# EAGLE design badge (EAGLE 8.2.2)

## Sheet 1 of 4
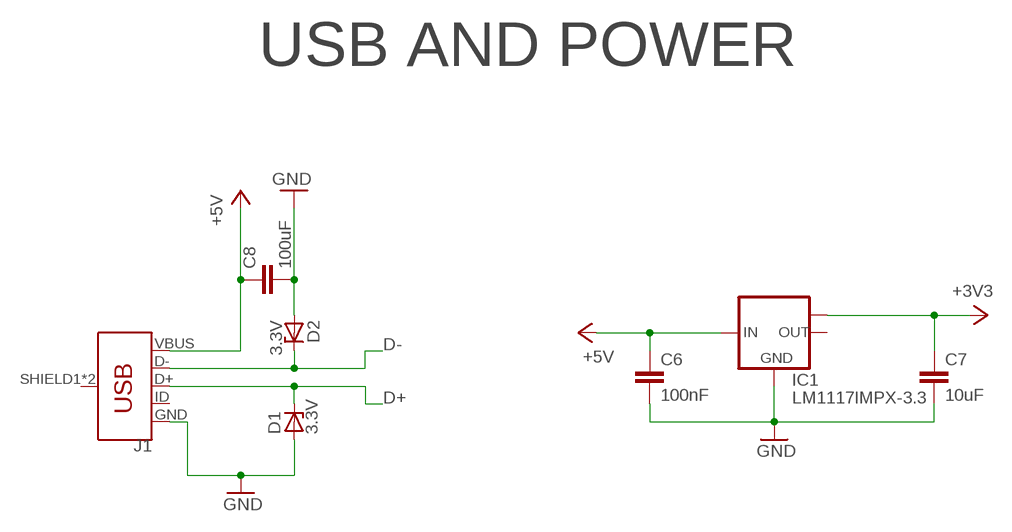
[diagram p0: schematic, sheet 1]

### Parts
C6  100nF  C-EUC0805  [C0805]
C7  10uF  C-EUC0805  [C0805]
C8  100uF  C-EUC1206  [C1206]
D1  3.3V  ZENER-DIODESOD80C  [SOD80C]
D2  3.3V  ZENER-DIODESOD80C  [SOD80C]
IC1  LM1117IMPX-3.3  [SOT223]
J1  USB_MICRO-B_FEMALE-SMT  [USB-B-MICRO-SMD]

### Nets
+3V3: C7.1 IC1.TAB(OUT1) ; also sheet 2,3
+5V: C6.1 C8.1 IC1.3(IN) J1.VBUS ; also sheet 2,3
D+: D1.C J1.D+ ; also sheet 2
D-: D2.C J1.D- ; also sheet 2
GND: C6.2 C7.2 C8.2 D1.A D2.A IC1.1(GND) J1.GND ; also sheet 2,3,4
Unconnected: IC1.2(OUT) J1.ID J1.SHIELD1(SHIELD) J1.SHIELD2(SHIELD)

### Notes on the sheet
- USB AND POWER

## Sheet 2 of 4
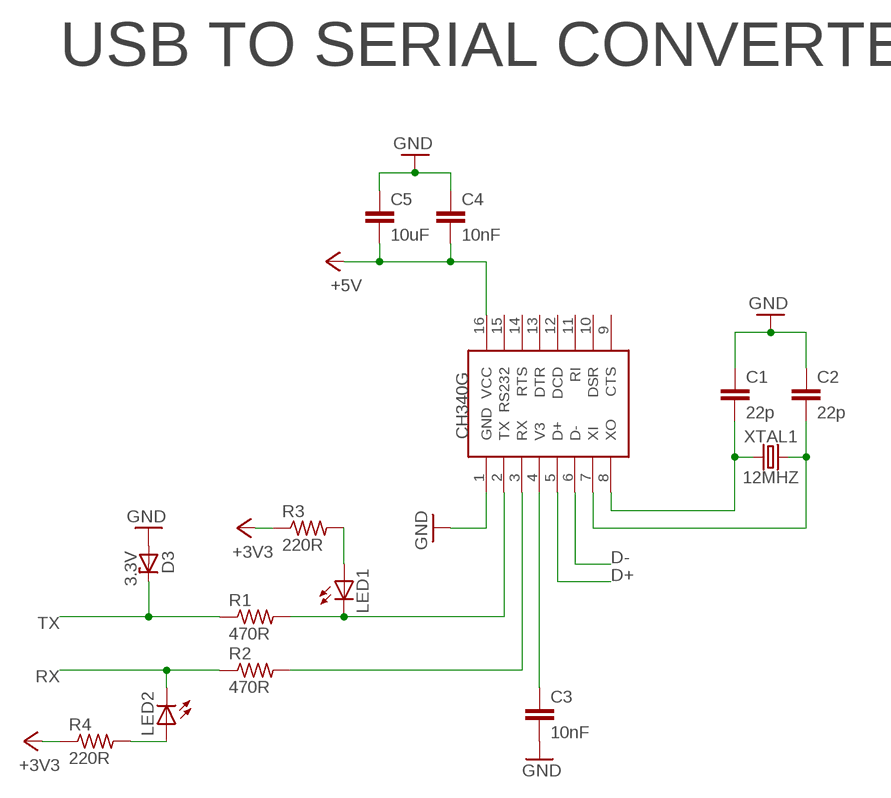
[diagram p1: schematic, sheet 2]

### Parts
C1  22p  C-EUC0805  [C0805]
C2  22p  C-EUC0805  [C0805]
C3  10nF  C-EUC0805  [C0805]
C4  10nF  C-EUC0805  [C0805]
C5  10uF  C-EUC0805  [C0805]
D3  3.3V  ZENER-DIODESOD80C  [SOD80C]
LED1  LEDSML0805  [SML0805]
LED2  LEDSML0805  [SML0805]
R1  470R  R-US_R0805  [R0805]
R2  470R  R-US_R0805  [R0805]
R3  220R  R-US_M0805  [M0805]
R4  220R  R-US_M0805  [M0805]
U$2  CH340G  [SOIC16]
XTAL1  12MHZ  CRYSTALSMD-HC49UP  [HC49UP]

### Nets
+3V3: R3.1 R4.1 ; also sheet 1,3
+5V: C4.2 C5.2 U$2.16(VCC) ; also sheet 1,3
CH_RX: R2.2 U$2.3(RX)
CH_TX: LED1.C R1.2 U$2.2(TX)
D+: U$2.5(D+) ; also sheet 1
D-: U$2.6(D-) ; also sheet 1
GND: C1.1 C2.1 C3.2 C4.1 C5.1 D3.A U$2.1(GND) ; also sheet 1,3,4
N$6: LED1.A R3.2
N$7: LED2.A R4.2
RX: LED2.C R2.1 ; also sheet 3
TX: D3.C R1.1 ; also sheet 3
V3: C3.1 U$2.4(V3)
XI: C2.2 U$2.7(XI) XTAL1.2
XO: C1.2 U$2.8(XO) XTAL1.1
Unconnected: U$2.9(CTS) U$2.10(DSR) U$2.11(RI) U$2.12(DCD) U$2.13(DTR) U$2.14(RTS) U$2.15(RS232)

### Notes on the sheet
- USB TO SERIAL CONVERTER

## Sheet 3 of 4
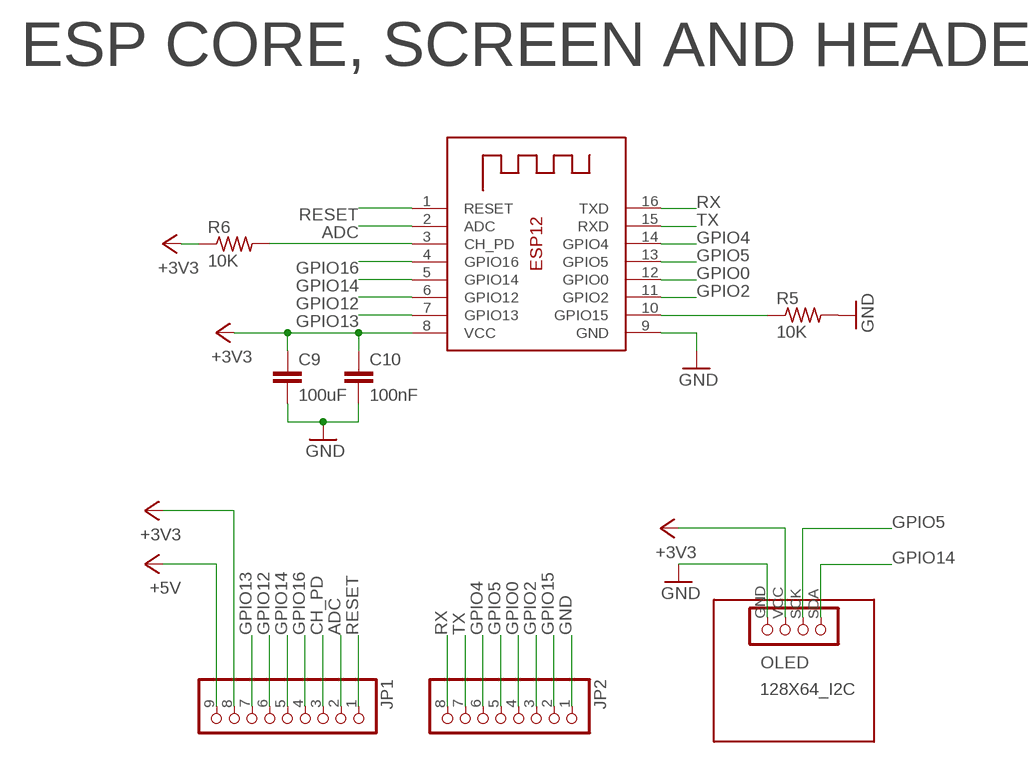
[diagram p2: schematic, sheet 3]

### Parts
C9  100uF  C-EUC1206  [C1206]
C10  100nF  C-EUC0805  [C0805]
JP1  PINHD-1X9  [1X09]
JP2  PINHD-1X8  [1X08]
OLED  128X64_I2C  OLED_128X64_I2C  [128X64_I2C]
R5  10K  R-US_R0805  [R0805]
R6  10K  R-US_R0805  [R0805]
X2  ESP-12F  ESP-12  [ESP-12]

### Nets
+3V3: C9.1 C10.1 JP1.8 OLED.VCC R6.1 X2.8(VCC) ; also sheet 1,2
+5V: JP1.9 ; also sheet 1,2
ADC: JP1.2 X2.2(ADC)
CH_PD: JP1.3 R6.2 X2.3(CH_PD)
GND: C9.2 C10.2 JP2.1 OLED.GND R5.2 X2.9(GND) ; also sheet 1,2,4
GPIO0: JP2.4 X2.12(GPIO0) ; also sheet 4
GPIO2: JP2.3 X2.11(GPIO2)
GPIO4: JP2.6 X2.14(GPIO4) ; also sheet 4
GPIO5: JP2.5 OLED.SCK X2.13(GPIO5)
GPIO12: JP1.6 X2.6(GPIO12) ; also sheet 4
GPIO13: JP1.7 X2.7(GPIO13)
GPIO14: JP1.5 OLED.SDA X2.5(GPIO14)
GPIO15: JP2.2 R5.1 X2.10(GPIO15)
GPIO16: JP1.4 X2.4(GPIO16)
RESET: JP1.1 X2.1(RESET) ; also sheet 4
RX: JP2.8 X2.16(TXD) ; also sheet 2
TX: JP2.7 X2.15(RXD) ; also sheet 2

### Notes on the sheet
- ESP CORE, SCREEN AND HEADERS

## Sheet 4 of 4
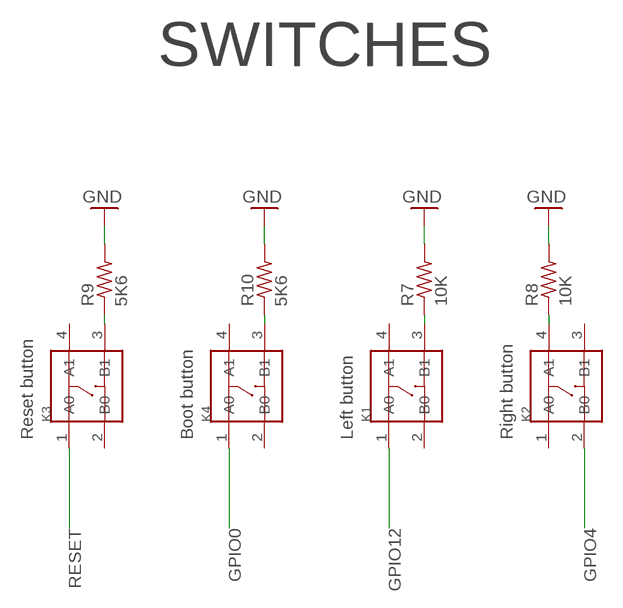
[diagram p3: schematic, sheet 4]

### Parts
K1  SMD-SWITCH-TACTILE-SPST-NO(4P-D6.0MM)  [SW4-SMD-6.0X6.0X5.0MM]
K2  SMD-SWITCH-TACTILE-SPST-NO(4P-D6.0MM)  [SW4-SMD-6.0X6.0X5.0MM]
K3  SMD-SWITCH-TACTILE-SPST-NO(4P-D6.0MM)  [SW4-SMD-6.0X6.0X5.0MM]
K4  SMD-SWITCH-TACTILE-SPST-NO(4P-D6.0MM)  [SW4-SMD-6.0X6.0X5.0MM]
R7  10K  R-US_R0805  [R0805]
R8  10K  R-US_R0805  [R0805]
R9  5K6  R-US_R0805  [R0805]
R10  5K6  R-US_R0805  [R0805]

### Nets
GND: R7.2 R8.2 R9.2 R10.2 ; also sheet 1,2,3
GPIO0: K4.1(A0) ; also sheet 3
GPIO4: K2.2(B0) ; also sheet 3
GPIO12: K1.1(A0) ; also sheet 3
N$1: K3.3(B1) R9.1
N$2: K4.3(B1) R10.1
N$3: K2.4(A1) R8.1
N$10: K1.3(B1) R7.1
RESET: K3.1(A0) ; also sheet 3
Unconnected: K1.2(B0) K1.4(A1) K2.1(A0) K2.3(B1) K3.2(B0) K3.4(A1) K4.2(B0) K4.4(A1)

### Notes on the sheet
- SWITCHES
- Reset button | Boot button | Left button | Right button

## Library data of the parts
C1-C10 = rcl:C-EU: CAPACITOR, European symbol
D1-D3 = diode:ZENER-DIODE: Z-Diode
IC1 = lm1117:LM1117IMPX-*
J1 = conectores:USB_MICRO-B: USB Type Micro-B Connector Male/female and PTH/SMT variants SparkFun Products: SparkFun microB USB Breakout <https://www.sparkfun.com/products/12035> SparkFun USB microB Plug Breakout <https://www.sparkfun.com/products/10031> SparkFun ESP8266 Thing <https://www.sparkfun.com/products/13231>; PROD_ID: CONN-11752
JP1 = pinhead:PINHD-1X9: PIN HEADER
JP2 = pinhead:PINHD-1X8: PIN HEADER
K1-K4 = Seeed-Switch:SMD-SWITCH-TACTILE-SPST-NO(4P-D6.0MM): 311020004; MPN: DTSM-62K-S-V-T/R(SN431)
LED1 LED2 = led:LED: LED OSRAM: - CHIPLED LG R971, LG N971, LY N971, LG Q971, LY Q971, LO R971, LY R971 LH N974, LH R974 LS Q976, LO Q976, LY Q976 LO Q996 - Hyper CHIPLED LW Q18S LB Q993, LB Q99A, LB R99A - SideLED LS A670, LO A670, LY A670, LG A670, LP A670 LB A673, LV A673, LT A673, LW A673 LH A674 LY A675 LS A676, LA A676, LO A676, LY A676, LW A676 LS A679, LY A679, LG A679 - Hyper Micro SIDELED® LS Y876, LA Y876, LO Y876, LY Y876 LT Y87S - SmartLED LW L88C, LW L88S LB L89C, LB L89S, LG L890 LS L89K, LO L89K, LY L89K LS L896, LA L896, LO L896, LY L896 - TOPLED LS T670, LO T670, LY T670, LG T670, LP T670 LSG T670, LSP T670, LSY T670, LOP T670, LYG T670 LG T671, LOG T671, LSG T671 LB T673, LV T673, LT T673, LW T673 LH T674 LS T676, LA T676, LO T676, LY T676, LB T676, LH T676, LSB T676, LW T676 LB T67C, LV T67C, LT T67C, LS T67K, LO T67K, LY T67K, LW E67C LS E67B, LA E67B, LO E67B, LY E67B, LB E67C, LV E67C, LT E67C LW T67C LS T679, LY T679, LG T679 LS T770, LO T770, LY T770, LG T770, LP T770 LB T773, LV T773, LT T773, LW T773 LH T774 LS E675, LA E675, LY E675, LS T675 LS T776, LA T776, LO T776, LY T776, LB T776 LHGB T686 LT T68C, LB T68C - Hyper Mini TOPLED® LB M676 - Mini TOPLED Santana® LG M470 LS M47K, LO M47K, LY M47K Source: http://www.osram.convergy.de LUXEON: - LUMILED® LXK2-PW12-R00, LXK2-PW12-S00, LXK2-PW14-U00, LXK2-PW14-V00 LXK2-PM12-R00, LXK2-PM12-S00, LXK2-PM14-U00 LXK2-PE12-Q00, LXK2-PE12-R00, LXK2-PE12-S00, LXK2-PE14-T00, LXK2-PE14-U00 LXK2-PB12-K00, LXK2-PB12-L00, LXK2-PB12-M00, LXK2-PB14-N00, LXK2-PB14-P00, LXK2-PB14-Q00 LXK2-PR12-L00, LXK2-PR12-M00, LXK2-PR14-Q00, LXK2-PR14-R00 LXK2-PD12-Q00, LXK2-PD12-R00, LXK2-PD12-S00 LXK2-PH12-R00, LXK2-PH12-S00 LXK2-PL12-P00, LXK2-PL12-Q00, LXK2-PL12-R00 Source: www.luxeon.com KINGBRIGHT: KA-3528ASYC Source: www.kingbright.com
OLED = pantallas:OLED_128X64_I2C
R1-R10 = rcl:R-US_: RESISTOR, American symbol
U$2 = ch340g:CH340G
X2 = adafruit:ESP-12
XTAL1 = SparkFun-Clocks:CRYSTAL: Crystals (Generic) These are passive quartz crystals, which can be used as a clock source for a microcontroller. Crystal's are two-terminal devices. They require external "load" capacitors to generate an oscillating signal.

## Net classes
0 default: width 0.152 mm, clearance 0.152 mm

## Board
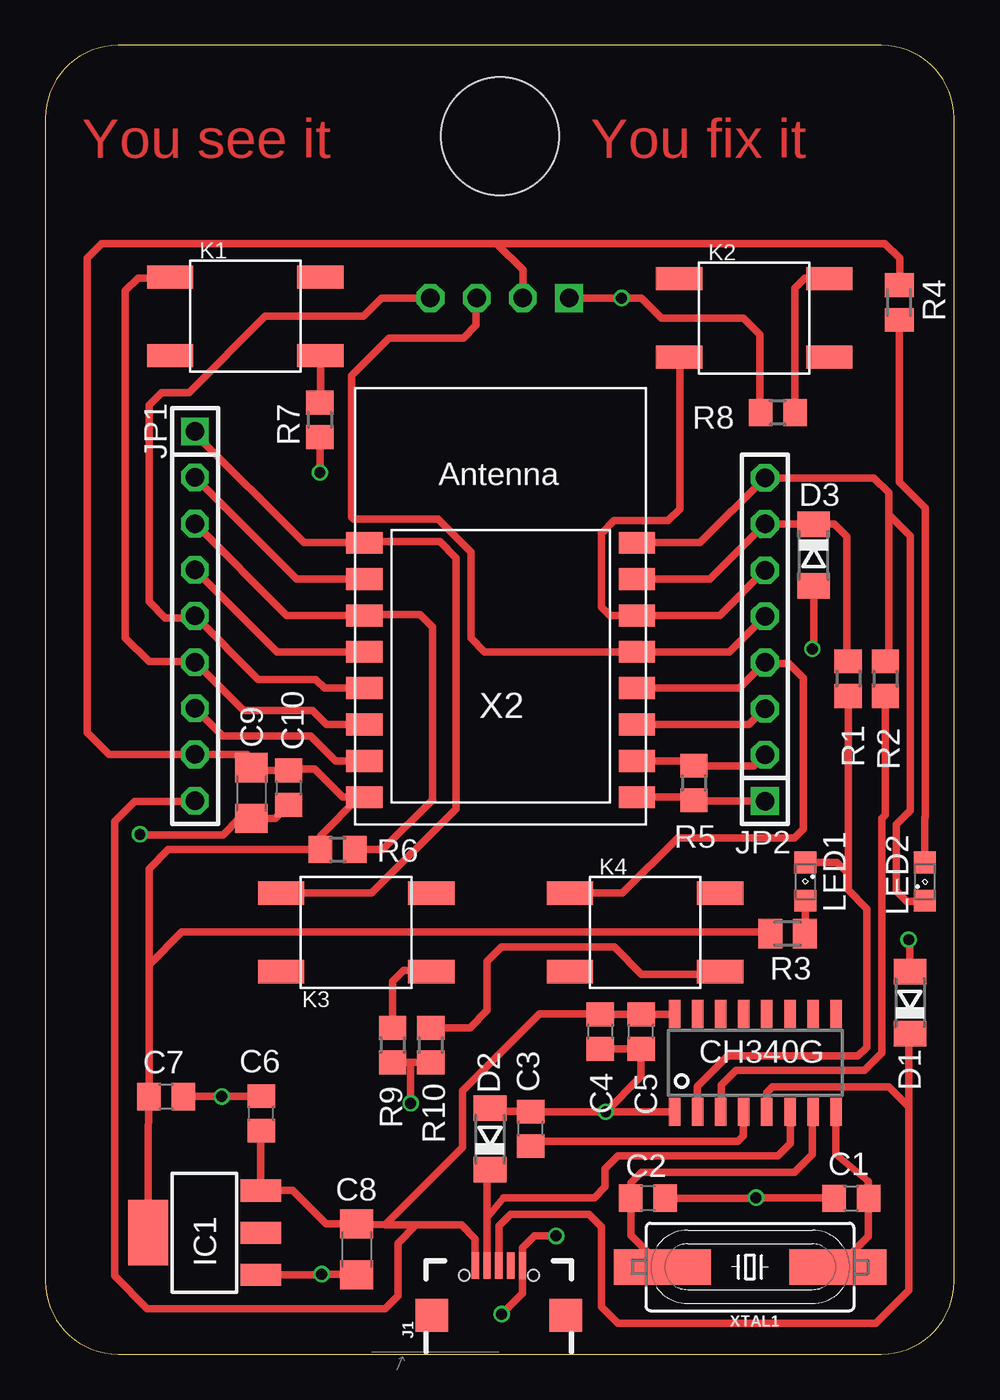
[diagram p4: board, top side]
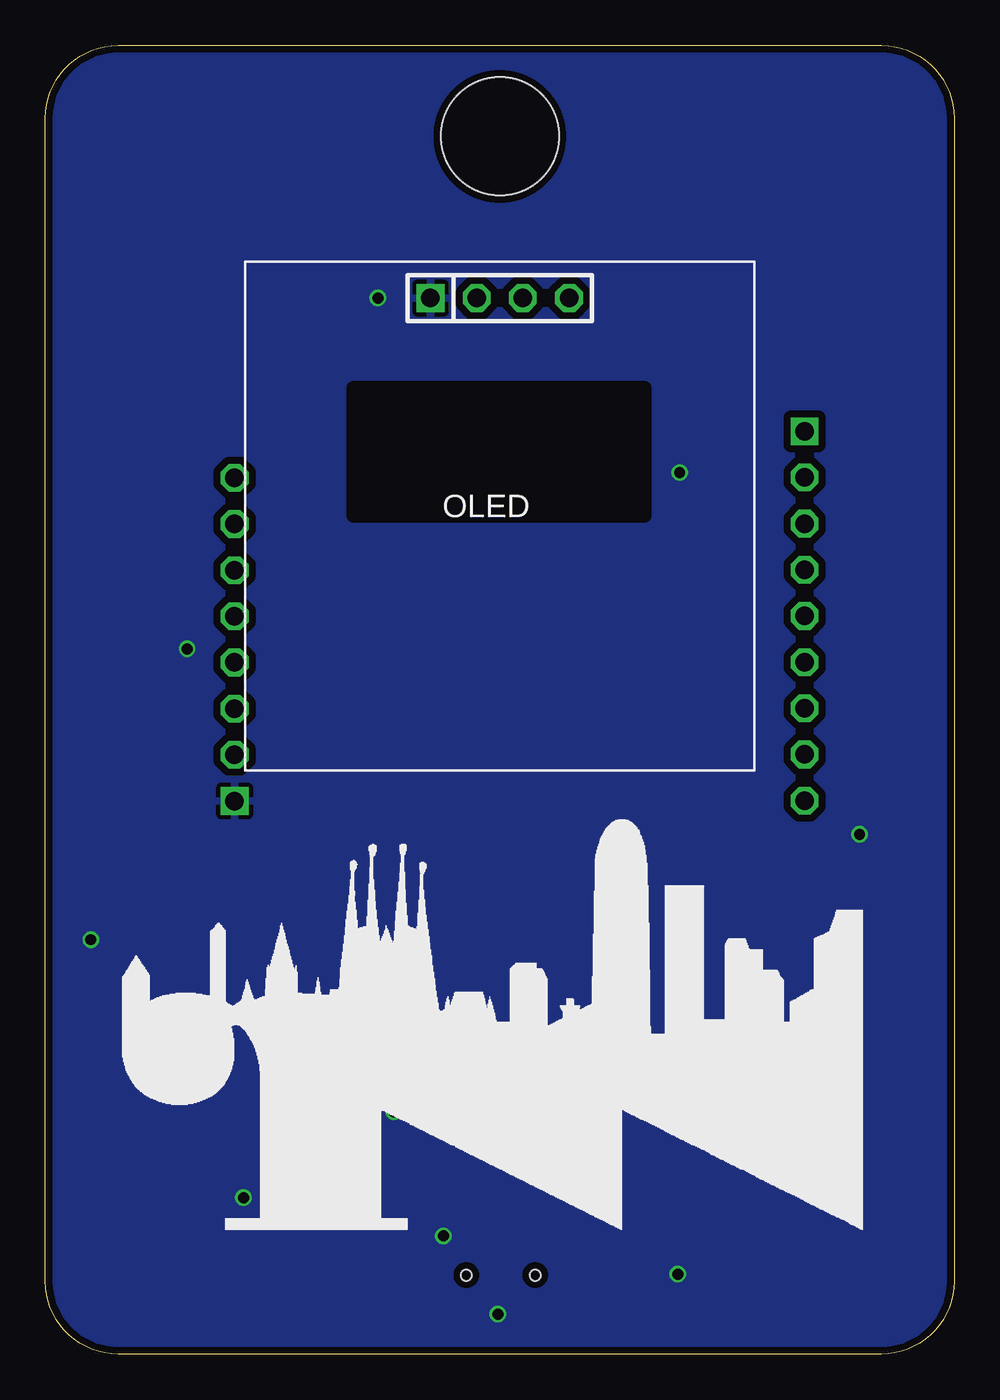
[diagram p5: board, bottom side, seen from below]

Size 50 x 72 mm. Coordinates in mm from the lower left corner, seen from the top.
Outline: 4,0 46,0 arc90 50,4 50,68 arc90 46,72 4,72 arc90 0,68 0,4 arc90 4,0
Copper layers (1*16): Top 0.035mm / dielectric 1.5mm / Bottom 0.035mm
Design rules "SeeedStudio_2layer_DRU_no_angle_20140221": minimum track width 6mil, minimum drill 12mil, track to track 6mil, track to pad 6mil, pad to pad 6mil, via to via 6mil, smd to smd 0mil, copper to edge 10mil, drill to drill 10mil, minimum pad ring 10mil, minimum via ring 6mil, stop-mask expansion 2mil, vias tented up to drill 100mil, thermal gap 10mil
Holes 6.5 mm at 25,67

### Footprints (pad centres in the part's own frame; a part is rotated, then mirrored left to right if it is on the bottom)
C0805 = smd 1.3 x 1.5: 1 -0.95,0; 2 0.95,0
C1206 = smd 1.6 x 1.8: 1 -1.4,0; 2 1.4,0
SOD80C = smd 1.4 x 1.8: A 1.7,0; C -1.7,0
SOT223 = smd 1.219 x 2.235: 1 -2.311,-3.099; 2 0,-3.099; 3 2.311,-3.099 | smd 3.6 x 2.2: TAB 0,3.099
USB-B-MICRO-SMD = smd 1.45 x 0.4: D+ 2.725,0; D- 2.725,0.65; GND 2.725,-1.3; ID 2.725,-0.65; VBUS 2.725,1.3 | smd 1.8 x 1.8: SHIELD1 0,3.685; SHIELD2 0,-3.685 | hole 0.6: 2.2,1.9; 2.2,-1.9
1X09 = drill 1.016 square: 1 -10.16,0 | drill 1.016 octagon: 2 -7.62,0; 3 -5.08,0; 4 -2.54,0; 5 0,0; 6 2.54,0; 7 5.08,0; 8 7.62,0; 9 10.16,0
1X08 = drill 1.016 square: 1 -8.89,0 | drill 1.016 octagon: 2 -6.35,0; 3 -3.81,0; 4 -1.27,0; 5 1.27,0; 6 3.81,0; 7 6.35,0; 8 8.89,0
SW4-SMD-6.0X6.0X5.0MM = smd 2.54 x 1.27: 1 -4.129,2.159; 2 -4.129,-2.159; 3 4.129,-2.159; 4 4.129,2.159
SML0805 = smd 1.2 x 1.2: A 1.05,0; C -1.05,0
128X64_I2C = drill 1.016 square: GND -3.81,0 | drill 1.016 octagon: SCK 1.27,0; SDA 3.81,0; VCC -1.27,0
R0805 = smd 1.3 x 1.5: 1 -0.95,0; 2 0.95,0
M0805 = smd 1.3 x 1.6: 1 -0.95,0; 2 0.95,0
SOIC16 = smd 0.635 x 1.524: 1 -4.445,-2.695; 2 -3.175,-2.695; 3 -1.905,-2.695; 4 -0.635,-2.695; 5 0.635,-2.695; 6 1.905,-2.695; 7 3.175,-2.695; 8 4.445,-2.695; 9 4.445,2.695; 10 3.175,2.695; 11 1.905,2.695; 12 0.635,2.695; 13 -0.635,2.695; 14 -1.905,2.695; 15 -3.175,2.695; 16 -4.445,2.695
ESP-12 = smd 2 x 1.2: 1 -7.5,4.5; 2 -7.5,2.5; 3 -7.5,0.5; 4 -7.5,-1.5; 5 -7.5,-3.5; 6 -7.5,-5.5; 7 -7.5,-7.5; 8 -7.5,-9.5; 9 7.5,-9.5; 10 7.5,-7.5; 11 7.5,-5.5; 12 7.5,-3.5; 13 7.5,-1.5; 14 7.5,0.5; 15 7.5,2.5; 16 7.5,4.5
HC49UP = smd 5.334 x 1.93: 1 -4.826,0; 2 4.826,0

### Placement (x,y rotation side)
C1  44.34,8.57 0 top
C2  33.16,8.58 180 top
C3  26.7,12.4 90 top
C4  32.78,17.74 90 top
C5  30.53,17.74 90 top
C6  11.88,13.24 90 top
C7  6.64,14.17 0 top
C8  17.12,5.76 270 top
C9  11.33,30.86 270 top
C10  13.38,31.16 270 top
D1  47.57,19.34 90 top
D2  24.46,11.84 90 top
D3  42.27,43.96 270 top
IC1  8.75,6.68 90 top
J1  24.95,2.14 90 top
JP1  8.23,40.61 270 top
JP2  39.59,39.32 90 top
K1  11,57.1 0 top
K2  39,57 0 top
K3  17.1,23.2 0 top
K4  33,23.2 0 top
LED1  41.82,26 270 top
LED2  48.39,26 90 top
OLED  25,58.1 0 bottom
R1  44.17,37.16 270 top
R2  46.22,37.16 270 top
R3  40.84,23.13 0 top
R4  46.98,57.86 270 top
R5  35.68,31.42 270 top
R6  16.08,27.76 0 top
R7  15.1,51.4 270 top
R8  40.3,51.8 180 top
R9  19.1,17 270 top
R10  21.2,17 270 top
U$2  39.06,16.02 0 top
X2  25.05,40.14 0 top
XTAL1  38.77,4.79 180 top

### Tracks (layer width: path | path; a pad name or v marks a point on that pad's centre or on a via)
+3V3
  Top 0.406: IC1.TAB 5.65,11.17 C7.1 5.7,21.4 | 8.43,32.99 JP1.8 3.51,32.99 2.3,34.2 2.3,60.3 3.1,61.1 24.84,61.1 | 8.43,32.99 11.1,32.99 C9.1 11.48,32.11 C10.1 13.34,32.06 13.48,32.2 14.8,32.2 16.36,30.64 17.25,30.64 | 8.41,33 8.43,32.99 | 17.25,30.64 X2.8 | 17.25,30.64 15.13,28.52 R6.1 6.76,27.76 5.7,26.7 5.7,21.4 | 26.3,58.13 OLED.VCC 26.27,59.66 24.84,61.1 | 5.7,21.4 7.51,23.21 39.81,23.21 R3.1 | R4.1 47,58.83 47,60.3 46.2,61.1 24.84,61.1
+5V
  Top 0.406: J1.VBUS 23.65,6.35 22.9,7.1 20.7,7.1 | 18.68,7.1 20.7,7.1 | 18.68,7.1 C8.1 15.44,7.16 13.6,9 IC1.3 11.85,11.16 11.87,12.05 | 18.68,7.1 22.95,11.37 22.95,14.49 27.17,18.71 30.5,18.71 C5.2 C4.2 34.59,18.69 U$2.16 | 11.88,12.27 11.87,12.05 | 11.88,12.27 C6.1 | 11.93,12.1 11.87,12.05 | JP1.9 8.1,30.32 8.02,30.4 4.9,30.4 3.8,29.3 3.8,4.3 5.6,2.5 18.7,2.5 19.4,3.2 19.4,6.1 20.4,7.1 20.7,7.1 | 11.91,12.3 11.88,12.27
ADC
  Top 0.406: X2.2 13.82,42.64 JP1.2
CH_PD
  Top 0.406: JP1.3 13.28,40.64 X2.3 17.61,40.7 20.6,40.7 21.3,40 21.3,30.5 18.56,27.76 R6.2
CH_RX
  Top 0.406: U$2.3 37.2,13.37 37.2,14.8 38,15.6 45.05,15.6 46.01,16.56 46.01,29.46 46.22,29.67 R2.2
CH_TX
  Top 0.406: U$2.2 35.88,14.73 37.56,16.41 44.71,16.41 45.19,16.89 45.19,18.14 45.2,18.15 45.2,24.5 44.17,25.53 44.17,26.43 | 44.17,26.43 R1.2 | LED1.C 43.55,27.05 44.17,26.43
D+
  Top 0.406: 47.5,13.6 47.5,3.5 45.7,1.7 31.5,1.7 30.6,2.6 30.6,7 29.9,7.7 25.6,7.7 24.95,7.05 J1.D+ | U$2.5 39.7,14.4 40,14.7 46.4,14.7 47.5,13.6 | 47.5,13.6 47.5,17.57 D1.C
D-
  Top 0.406: J1.D- 24.3,7.5 | 24.3,7.5 25.2,8.6 30.2,8.6 30.8,9.2 30.8,10.2 31.5,10.9 40.3,10.9 41,11.6 41,13.29 U$2.6 | 24.3,7.5 24.3,9.98 D2.C
GND  (via drill 0.6)
  Top 0.406: IC1.1 15.17,4.37 | v28.1,6.5 26.9,6.5 26.25,5.85 J1.GND 26.25,3.35 v25.1,2.2 | v30.83,13.32 U$2.1 | D2.A 24.65,13.35 C3.2 26.73,13.32 30.43,13.32 | C2.1 39.08,8.58 v39.1,8.6 43.36,8.6 C1.1 | 30.43,13.32 v30.83,13.32 | C7.2 v9.7,14.17 11.86,14.17 C6.2 | C5.1 C4.1 32.78,15.27 v30.83,13.32 | 30.53,13.42 30.43,13.32 | 19.04,15.99 R9.2 20.1,16.05 | v20.1,13.8 20.1,16.05 | v15.2,4.4 17.08,4.4 C8.2 | v5.2,28.6 5.23,28.57 9.77,28.57 10.66,29.46 C9.2 12.63,29.46 C10.2 | JP2.1 35.72,30.43 R5.2 35.51,30.64 X2.9 | R7.2 v15.1,48.5 | OLED.GND v31.7,58.1 32.8,58.1 33.9,57 38.4,57 39.3,56.1 39.3,51.85 R8.2 | D3.A 42.27,38.87 v42.2,38.8 | D1.A 47.57,22.73 v47.5,22.8 | 20.1,16.05 R10.2
  Top 0.61: 15.17,4.37 v15.2,4.4
  Bottom 0.406: v30.83,13.32 v30.82,13.32 30.8,13.3 | v20.1,13.8 20,13.8
  pour Bottom (isolate 0.4): 0,72 50,72 50,0 0,0
GPIO0
  Top 0.406: 32.51,36.6 X2.12 38.18,36.64 JP2.4 39.64,38 40.9,38 41.7,37.2 41.7,28.9 41.2,28.4 34.8,28.4 31.76,25.36 K4.1
GPIO2
  Top 0.406: X2.11 38.72,34.64 JP2.3
GPIO4
  Top 0.406: JP2.6 37.1,40.64 X2.14 31.06,40.64 30.6,41.1 30.6,45.15 31.3,45.85 34.25,45.85 34.9,46.5 34.9,54.81 K2.2
GPIO5
  Top 0.406: JP2.5 37.64,38.64 X2.13 24.16,38.64 23.41,39.39 23.41,44.14 21.61,45.94 16.97,45.94 16.85,46.06 16.85,53.85 18.9,55.9 23,55.9 23.7,56.6 23.7,58.07 OLED.SCK
GPIO12
  Top 0.406: X2.6 15.46,34.64 14.7,35.4 10.9,35.4 JP1.6 8.2,38.1 5.7,38.1 4.4,39.4 4.4,58.5 5.1,59.2 6.2,59.2 6.3,59.1 6.71,59.1 K1.1
GPIO13
  Top 0.406: X2.7 15.96,32.64 14.6,34 9.76,34 JP1.7
GPIO14
  Top 0.406: X2.5 15.36,36.64 14.87,37.13 11.71,37.13 JP1.5 8.12,40.5 6.6,40.5 5.7,41.4 5.7,52.2 6.4,52.9 7.9,52.9 12.1,57.1 17.5,57.1 18.5,58.1 OLED.SDA
GPIO15
  Top 0.406: X2.10 35.41,32.64 R5.1 38.99,32.37 JP2.2
GPIO16
  Top 0.406: X2.4 12.74,38.64 JP1.4
N$1
  Top 0.406: R9.1 19.1,20.5 19.7,21.1 21.17,21.1 K3.3
N$2
  Top 0.406: R10.1 23.35,17.95 24.3,18.9 24.3,21.6 25.1,22.4 31.3,22.4 32.8,20.9 36.99,20.9 K4.3
N$3
  Top 0.406: R8.1 41.25,53.95 41.25,58.65 41.8,59.2 43.09,59.2 K2.4
N$6
  Top 0.406: LED1.A 41.82,23.16 R3.2
N$7
  Top 0.406: R4.2 46.98,47.97 48.41,46.53 48.41,29.57 48.39,29.54 LED2.A
N$10
  Top 0.406: K1.3 15.13,52.38 R7.1
RESET
  Top 0.406: JP1.1 8.16,50.7 14.22,44.64 X2.1 17.61,44.7 21.7,44.7 22.6,43.8 22.6,30 17.96,25.36 K3.1
RX
  Top 0.406: X2.16 36.02,44.64 JP2.8 45.59,48.21 46.4,47.4 46.4,46.2 | 46.4,46.2 47.6,45 47.6,29.9 46.83,29.13 46.83,25.47 47.4,24.9 48.34,24.9 LED2.C 48.33,25.1 | R2.1 46.4,38.13 46.4,46.2
TX
  Top 0.406: X2.15 36.56,42.64 JP2.7 | 39.63,45.71 JP2.7 | JP2.7 40.76,45.67 D3.C 43.41,45.66 44.1,44.97 44.1,38.18 R1.1
V3
  Top 0.406: U$2.4 38.5,13.25 38.4,13.15 38.4,12 38.11,11.71 26.96,11.71 C3.1
XI
  Top 0.406: U$2.7 42.2,13.29 42.2,11 41.2,10 32.8,10 32.21,9.41 C2.2 32.21,6.52 XTAL1.2
XO
  Top 0.406: U$2.8 43.5,11 45.29,9.51 C1.2 45.29,6.48 XTAL1.1

### Text on the board
Top: You see it | You fix it
tStop: You see it | You fix it